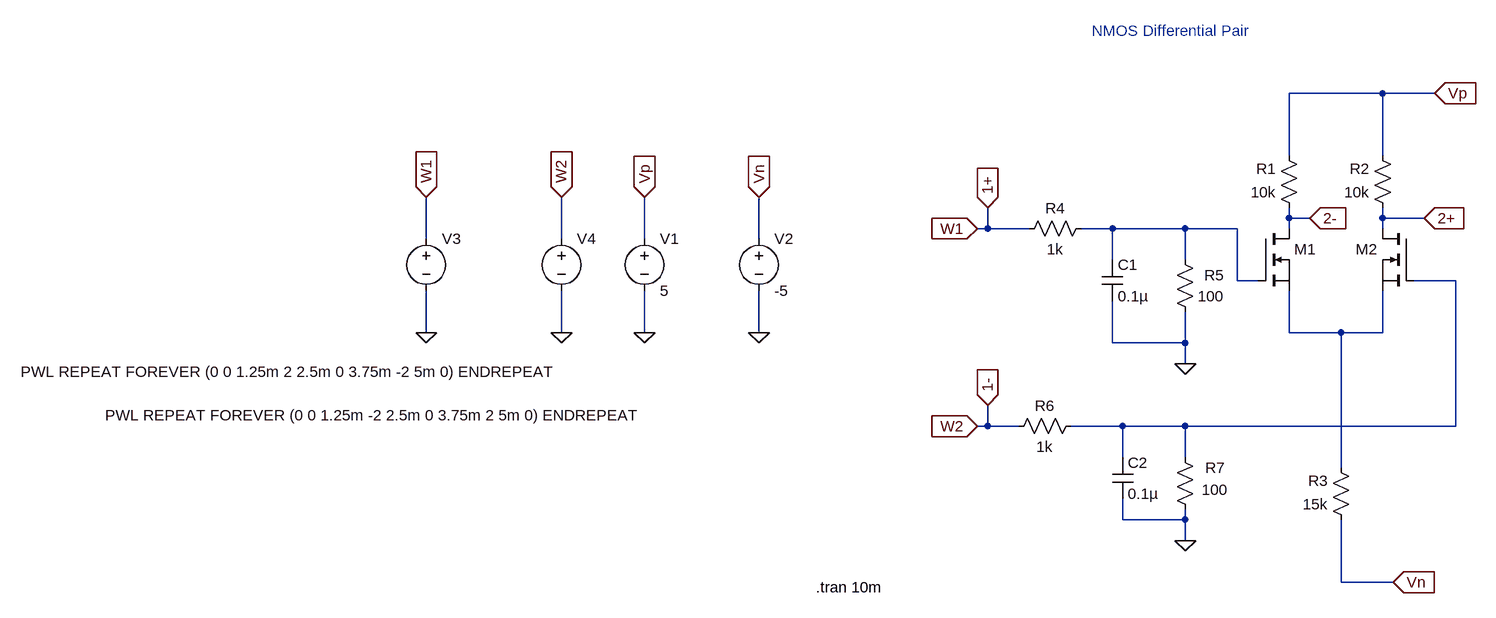
[diagram p0: schematic diff_pair_tail_res_mos_ltspice.asc]
diff_pair_tail_res_mos_ltspice.asc, the LTspice schematic file:
Version 4
SHEET 1 1032 680
WIRE 672 -208 528 -208
WIRE 752 -208 672 -208
WIRE 528 -112 528 -208
WIRE 672 -112 672 -208
WIRE 528 -16 528 -32
WIRE 560 -16 528 -16
WIRE 672 -16 672 -32
WIRE 736 -16 672 -16
WIRE 64 0 64 -32
WIRE 64 0 48 0
WIRE 128 0 64 0
WIRE 256 0 208 0
WIRE 368 0 256 0
WIRE 448 0 368 0
WIRE 528 0 528 -16
WIRE 672 0 672 -16
WIRE -800 16 -800 -48
WIRE -592 16 -592 -48
WIRE -464 16 -464 -48
WIRE -288 16 -288 -48
WIRE 256 48 256 0
WIRE 368 48 368 0
WIRE 448 80 448 0
WIRE 480 80 448 80
WIRE 784 80 720 80
WIRE -800 160 -800 96
WIRE -592 160 -592 96
WIRE -464 160 -464 96
WIRE -288 160 -288 96
WIRE 528 160 528 96
WIRE 608 160 528 160
WIRE 672 160 672 96
WIRE 672 160 608 160
WIRE 256 176 256 112
WIRE 368 176 368 128
WIRE 368 176 256 176
WIRE 368 208 368 176
WIRE 64 304 64 272
WIRE 64 304 48 304
WIRE 112 304 64 304
WIRE 272 304 192 304
WIRE 368 304 272 304
WIRE 784 304 784 80
WIRE 784 304 368 304
WIRE 272 352 272 304
WIRE 368 352 368 304
WIRE 608 368 608 160
WIRE 272 448 272 416
WIRE 368 448 368 432
WIRE 368 448 272 448
WIRE 368 480 368 448
WIRE 608 544 608 448
WIRE 688 544 608 544
FLAG 368 208 0
FLAG 368 480 0
FLAG 752 -208 Vp
IOPIN 752 -208 In
FLAG 688 544 Vn
IOPIN 688 544 In
FLAG 48 0 W1
IOPIN 48 0 In
FLAG 48 304 W2
IOPIN 48 304 In
FLAG -464 160 0
FLAG -288 160 0
FLAG -800 160 0
FLAG -592 160 0
FLAG -464 -48 Vp
IOPIN -464 -48 In
FLAG -288 -48 Vn
IOPIN -288 -48 In
FLAG -800 -48 W1
IOPIN -800 -48 In
FLAG -592 -48 W2
IOPIN -592 -48 In
FLAG 736 -16 2+
IOPIN 736 -16 In
FLAG 560 -16 2-
IOPIN 560 -16 In
FLAG 64 -32 1+
IOPIN 64 -32 In
FLAG 64 272 1-
IOPIN 64 272 In
SYMBOL res 544 -16 R180
WINDOW 0 36 76 Left 2
WINDOW 3 36 40 Left 2
SYMATTR InstName R1
SYMATTR Value 10k
SYMBOL res 688 -16 R180
WINDOW 0 36 76 Left 2
WINDOW 3 36 40 Left 2
SYMATTR InstName R2
SYMATTR Value 10k
SYMBOL res 624 464 R180
WINDOW 0 36 76 Left 2
WINDOW 3 36 40 Left 2
SYMATTR InstName R3
SYMATTR Value 15k
SYMBOL res 112 16 R270
WINDOW 0 32 56 VTop 2
WINDOW 3 0 56 VBottom 2
SYMATTR InstName R4
SYMATTR Value 1k
SYMBOL res 384 144 R180
WINDOW 0 -44 72 Left 2
WINDOW 3 -44 40 Left 2
SYMATTR InstName R5
SYMATTR Value 100
SYMBOL res 96 320 R270
WINDOW 0 32 56 VTop 2
WINDOW 3 0 56 VBottom 2
SYMATTR InstName R6
SYMATTR Value 1k
SYMBOL res 384 448 R180
WINDOW 0 -46 80 Left 2
WINDOW 3 -50 46 Left 2
SYMATTR InstName R7
SYMATTR Value 100
SYMBOL cap 240 48 R0
SYMATTR InstName C1
SYMATTR Value 0.1µ
SYMBOL cap 256 352 R0
SYMATTR InstName C2
SYMATTR Value 0.1µ
SYMBOL voltage -464 0 R0
WINDOW 123 0 0 Left 0
WINDOW 39 0 0 Left 0
SYMATTR InstName V1
SYMATTR Value 5
SYMBOL voltage -288 0 R0
WINDOW 123 0 0 Left 0
WINDOW 39 0 0 Left 0
SYMATTR InstName V2
SYMATTR Value -5
SYMBOL voltage -800 0 R0
WINDOW 3 -624 220 Left 2
WINDOW 123 0 0 Left 0
WINDOW 39 0 0 Left 0
SYMATTR Value PWL REPEAT FOREVER (0 0 1.25m 2 2.5m 0 3.75m -2 5m 0) ENDREPEAT
SYMATTR InstName V3
SYMBOL voltage -592 0 R0
WINDOW 3 -702 287 Left 2
WINDOW 123 0 0 Left 0
WINDOW 39 0 0 Left 0
SYMATTR Value PWL REPEAT FOREVER (0 0 1.25m -2 2.5m 0 3.75m 2 5m 0) ENDREPEAT
SYMATTR InstName V4
SYMBOL nmos 480 0 R0
WINDOW 3 56 72 Invisible 2
SYMATTR Value BSP89
SYMATTR InstName M1
SYMBOL nmos 720 0 M0
WINDOW 3 56 72 Invisible 2
SYMATTR Value BSP89
SYMATTR InstName M2
TEXT -200 552 Left 2 !.tran 10m
TEXT 224 -304 Left 2 ;NMOS Differential Pair

The netlist it stands for:
* diff_pair_tail_res_mos_ltspice.asc
R1 2- Vp 10k
R2 2+ Vp 10k
R3 Vn N003 15k
R4 1+ N001 1k
R5 0 N001 100
R6 1- N002 1k
R7 0 N002 100
C1 N001 0 0.1µ
C2 N002 0 0.1µ
V1 Vp 0 5
V2 Vn 0 -5
V3 1+ 0 PWL REPEAT FOREVER (0 0 1.25m 2 2.5m 0 3.75m -2 5m 0) ENDREPEAT
V4 1- 0 PWL REPEAT FOREVER (0 0 1.25m -2 2.5m 0 3.75m 2 5m 0) ENDREPEAT
M1 2- N001 N003 N003 BSP89
M2 2+ N002 N003 N003 BSP89
.model NMOS NMOS
.model PMOS PMOS
.lib standard.mos
.tran 10m
* NMOS Differential Pair
.backanno
.end